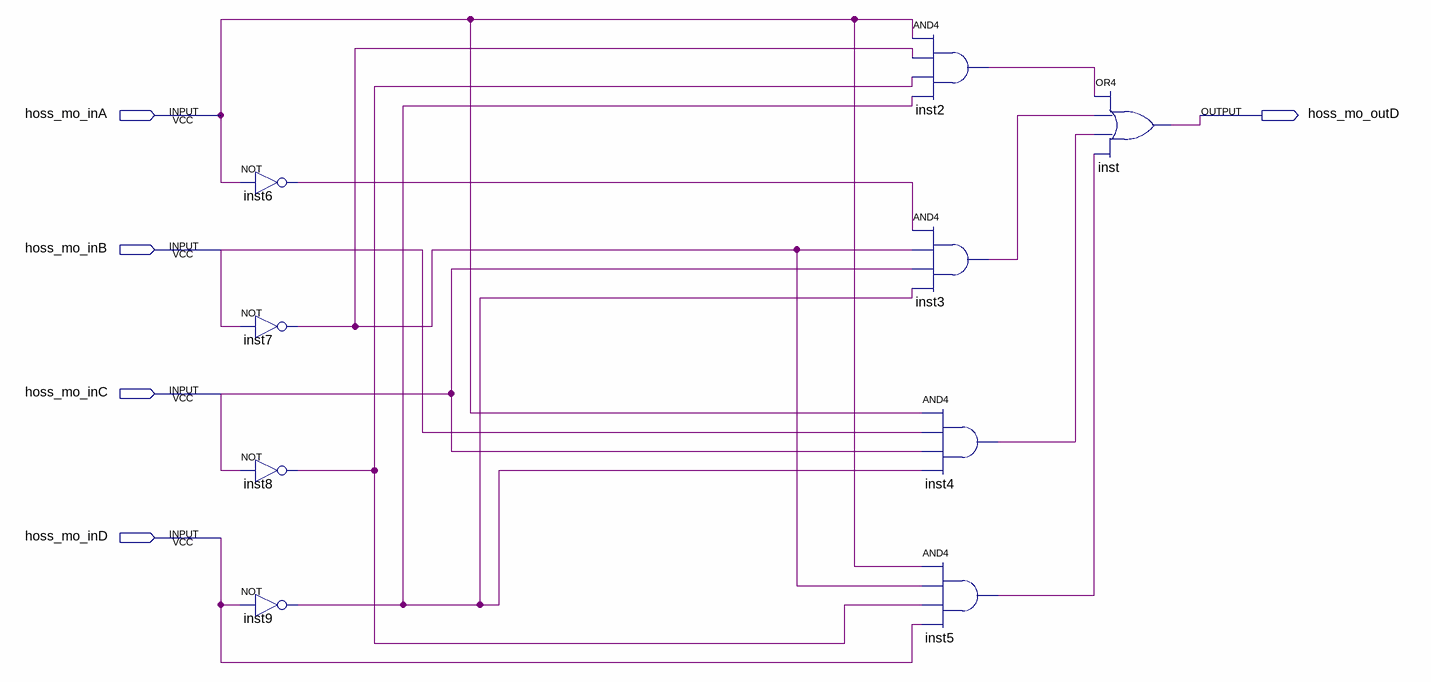
[diagram p0: schematic sheet]
// Quartus schematic segmentD.bdf as structural Verilog: 9 symbols, 5 pins
module segmentD (
  input  hoss_mo_inA,
  input  hoss_mo_inB,
  input  hoss_mo_inC,
  input  hoss_mo_inD,
  output hoss_mo_outD
);

  wire inst2_out, inst3_out, inst4_out, inst5_out, inst6_out, inst7_out, inst8_out, inst9_out;

  not inst6 (inst6_out, hoss_mo_inA);
  not inst7 (inst7_out, hoss_mo_inB);
  not inst8 (inst8_out, hoss_mo_inC);
  not inst9 (inst9_out, hoss_mo_inD);
  and inst2 (inst2_out, hoss_mo_inA, inst7_out, inst8_out, inst9_out);
  and inst3 (inst3_out, inst6_out, inst7_out, hoss_mo_inC, inst9_out);
  and inst4 (inst4_out, hoss_mo_inA, hoss_mo_inB, hoss_mo_inC, inst9_out);
  and inst5 (inst5_out, hoss_mo_inA, inst7_out, inst8_out, hoss_mo_inD);
  or inst (hoss_mo_outD, inst2_out, inst3_out, inst4_out, inst5_out);
endmodule
